# EAGLE design board 4 (EAGLE 8.4.1)
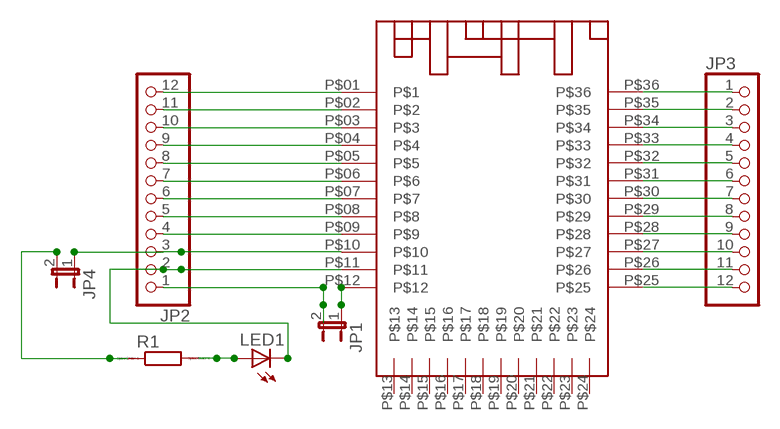
[diagram p0: schematic, sheet 1]

## Parts
JP1  JP1E  [JP1]
JP2  PINHD-1X12  [1X12]
JP3  PINHD-1X12  [1X12]
JP4  JP1E  [JP1]
LED1  LED5MM  [LED5MM]
R1  R0207/10  [0207/10]
U$1  HZX_MODULE  [SMD_PAD_VERSION]

## Nets
N$1: LED1.A R1.2
N$2: JP2.3 JP4.1 U$1.P$10
N$3: JP2.2 LED1.K(C) U$1.P$11
N$4: JP2.4 U$1.P$09
N$5: JP2.5 U$1.P$08
N$6: JP2.6 U$1.P$07
N$7: JP2.7 U$1.P$06
N$8: JP2.8 U$1.P$05
N$9: JP2.9 U$1.P$04
N$10: JP2.10 U$1.P$03
N$11: JP2.11 U$1.P$02
N$12: JP2.12 U$1.P$01
N$13: JP3.1 U$1.P$36
N$14: JP3.2 U$1.P$35
N$15: JP3.3 U$1.P$34
N$16: JP3.4 U$1.P$33
N$17: JP3.5 U$1.P$32
N$18: JP3.6 U$1.P$31
N$19: JP3.7 U$1.P$30
N$20: JP3.8 U$1.P$29
N$21: JP3.9 U$1.P$28
N$22: JP3.10 U$1.P$27
N$23: JP3.11 U$1.P$26
N$24: JP3.12 U$1.P$25
N$25: JP1.2 JP2.1
N$26: JP1.1 U$1.P$12
N$27: JP4.2 R1.1
Unconnected: U$1.P$13 U$1.P$14 U$1.P$15 U$1.P$16 U$1.P$17 U$1.P$18 U$1.P$19 U$1.P$20 U$1.P$21 U$1.P$22 U$1.P$23 U$1.P$24

## Library data of the parts
JP1 JP4 = jumper:JP1E: JUMPER
JP2 JP3 = pinhead:PINHD-1X12: PIN HEADER
LED1 = led:LED: LED OSRAM: - CHIPLED LG R971, LG N971, LY N971, LG Q971, LY Q971, LO R971, LY R971 LH N974, LH R974 LS Q976, LO Q976, LY Q976 LO Q996 - Hyper CHIPLED LW Q18S LB Q993, LB Q99A, LB R99A - SideLED LS A670, LO A670, LY A670, LG A670, LP A670 LB A673, LV A673, LT A673, LW A673 LH A674 LY A675 LS A676, LA A676, LO A676, LY A676, LW A676 LS A679, LY A679, LG A679 - Hyper Micro SIDELED® LS Y876, LA Y876, LO Y876, LY Y876 LT Y87S - SmartLED LW L88C, LW L88S LB L89C, LB L89S, LG L890 LS L89K, LO L89K, LY L89K LS L896, LA L896, LO L896, LY L896 - TOPLED LS T670, LO T670, LY T670, LG T670, LP T670 LSG T670, LSP T670, LSY T670, LOP T670, LYG T670 LG T671, LOG T671, LSG T671 LB T673, LV T673, LT T673, LW T673 LH T674 LS T676, LA T676, LO T676, LY T676, LB T676, LH T676, LSB T676, LW T676 LB T67C, LV T67C, LT T67C, LS T67K, LO T67K, LY T67K, LW E67C LS E67B, LA E67B, LO E67B, LY E67B, LB E67C, LV E67C, LT E67C LW T67C LS T679, LY T679, LG T679 LS T770, LO T770, LY T770, LG T770, LP T770 LB T773, LV T773, LT T773, LW T773 LH T774 LS E675, LA E675, LY E675, LS T675 LS T776, LA T776, LO T776, LY T776, LB T776 LHGB T686 LT T68C, LB T68C - Hyper Mini TOPLED® LB M676 - Mini TOPLED Santana® LG M470 LS M47K, LO M47K, LY M47K Source: http://www.osram.convergy.de LUXEON: - LUMILED® LXK2-PW12-R00, LXK2-PW12-S00, LXK2-PW14-U00, LXK2-PW14-V00 LXK2-PM12-R00, LXK2-PM12-S00, LXK2-PM14-U00 LXK2-PE12-Q00, LXK2-PE12-R00, LXK2-PE12-S00, LXK2-PE14-T00, LXK2-PE14-U00 LXK2-PB12-K00, LXK2-PB12-L00, LXK2-PB12-M00, LXK2-PB14-N00, LXK2-PB14-P00, LXK2-PB14-Q00 LXK2-PR12-L00, LXK2-PR12-M00, LXK2-PR14-Q00, LXK2-PR14-R00 LXK2-PD12-Q00, LXK2-PD12-R00, LXK2-PD12-S00 LXK2-PH12-R00, LXK2-PH12-S00 LXK2-PL12-P00, LXK2-PL12-Q00, LXK2-PL12-R00 Source: www.luxeon.com KINGBRIGHT: KA-3528ASYC Source: www.kingbright.com
R1 = eagle-ltspice:R: RESISTOR, European symbol; SPICEMODEL: NONE; SPICEPREFIX: R
U$1 = HZX_MODULE:HZX_MODULE; AUTHOR: Agam

## Board
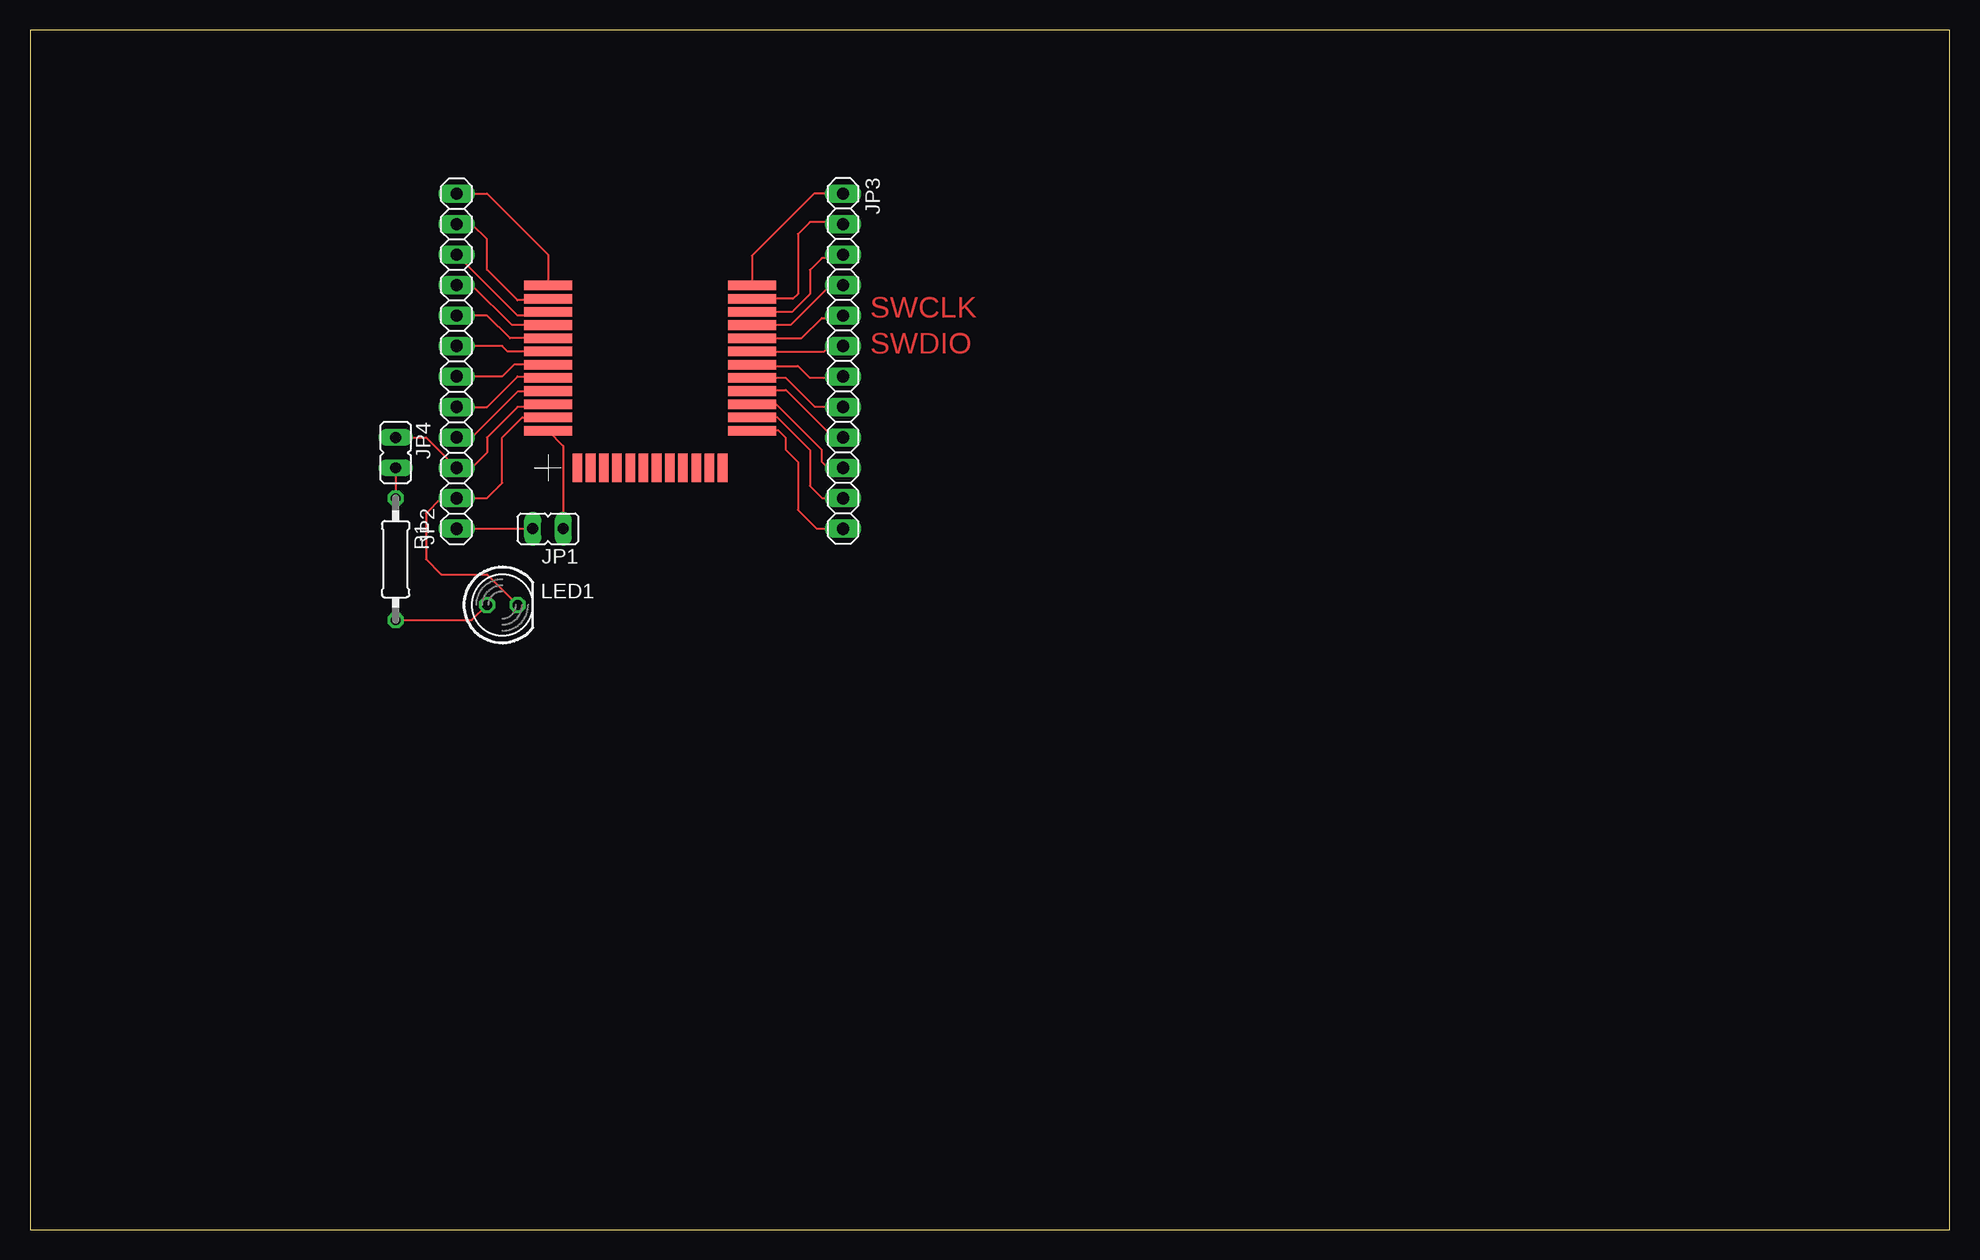
[diagram p1: board, top side]

Size 160 x 100 mm. Coordinates in mm from the lower left corner, seen from the top.
Outline: 0,0 160,0 160,100 0,100 0,0
Copper layers (1*16): Top 0.035mm / dielectric 1.5mm / Bottom 0.035mm
Design rules "default": minimum track width 6mil, minimum drill 0.35mm, track to track 6mil, track to pad 6mil, pad to pad 6mil, via to via 6mil, smd to smd 6mil, copper to edge 40mil, drill to drill 6mil, minimum pad ring 10mil, minimum via ring 8mil, stop-mask expansion 4mil, vias tented up to drill 0mil, thermal gap 10mil

### Footprints (pad centres in the part's own frame; a part is rotated, then mirrored left to right if it is on the bottom)
JP1 = drill 0.914 long: 1 0,-1.27; 2 0,1.27
1X12 = drill 1.016 long: 1 -13.97,0; 2 -11.43,0; 3 -8.89,0; 4 -6.35,0; 5 -3.81,0; 6 -1.27,0; 7 1.27,0; 8 3.81,0; 9 6.35,0; 10 8.89,0; 11 11.43,0; 12 13.97,0
LED5MM = drill 0.813 octagon: A -1.27,0; K 1.27,0
0207/10 = drill 0.813 octagon: 1 -5.08,0; 2 5.08,0
SMD_PAD_VERSION = smd 4 x 0.8: P$01 0,15.2; P$02 0,14.1; P$03 0,13; P$04 0,11.9; P$05 0,10.8; P$06 0,9.7; P$07 0,8.6; P$08 0,7.5; P$09 0,6.4; P$10 0,5.3; P$11 0,4.2; P$12 0,3.1; P$25 17,3.1; P$26 17,4.2; P$27 17,5.3; P$28 17,6.4; P$29 17,7.5; P$30 17,8.6; P$31 17,9.7; P$32 17,10.8; P$33 17,11.9; P$34 17,13; P$35 17,14.1; P$36 17,15.2 | smd 0.8 x 2.4: P$13 2.45,0; P$14 3.55,0; P$15 4.65,0; P$16 5.75,0; P$17 6.85,0; P$18 7.95,0; P$19 9.05,0; P$20 10.15,0; P$21 11.25,0; P$22 12.35,0; P$23 13.45,0; P$24 14.55,0

### Placement (x,y rotation side)
JP1  43.18,58.42 90 top
JP2  35.56,72.39 90 top
JP3  67.77,72.39 270 top
JP4  30.48,64.77 180 top
LED1  39.37,52.07 0 top
R1  30.48,55.88 270 top
U$1  43.18,63.5 0 top

### Tracks (layer width: path | path; a pad name or v marks a point on that pad's centre or on a via)
N$1
  Top 0.152: R1.2 36.83,50.8 LED1.A
N$2
  Top 0.152: U$1.P$10 42.96,68.58 40.64,68.58 38.1,66.04 38.1,64.77 36.83,63.5 JP2.3 33.02,66.04 JP4.1
N$3
  Top 0.152: LED1.K 38.1,54.61 34.29,54.61 33.02,55.88 33.02,59.69 34.29,60.96 JP2.2 38.1,60.96 39.37,62.23 39.37,66.04 41.03,67.7 U$1.P$11
N$4
  Top 0.152: U$1.P$09 43.13,69.85 40.64,69.85 36.83,66.04 JP2.4
N$5
  Top 0.152: JP2.5 38.1,68.58 40.64,71.12 41.91,71.12 42.03,71 U$1.P$08
N$6
  Top 0.152: U$1.P$07 40.35,72.1 39.37,71.12 JP2.6
N$7
  Top 0.152: U$1.P$06 39.83,73.2 39.37,73.66 JP2.7
N$8
  Top 0.152: U$1.P$05 40,74.3 38.1,76.2 JP2.8
N$9
  Top 0.152: U$1.P$04 40.17,75.4 36.83,78.74 JP2.9
N$10
  Top 0.152: U$1.P$03 42.88,76.2 40.64,76.2 JP2.10
N$11
  Top 0.152: U$1.P$02 43.05,77.47 40.64,77.47 38.1,80.01 38.1,82.55 36.83,83.82 JP2.11
N$12
  Top 0.152: JP2.12 38.1,86.36 43.18,81.28 U$1.P$01
N$13
  Top 0.152: JP3.1 65.36,86.36 60.18,81.18 U$1.P$36
N$14
  Top 0.152: JP3.2 67.59,84 65,84 64,83 64,78 63.6,77.6 U$1.P$35
N$15
  Top 0.152: JP3.3 67.49,81 66,81 65,80 65,78 63.5,76.5 U$1.P$34
N$16
  Top 0.152: JP3.4 66.74,78.74 63.4,75.4 U$1.P$33
N$17
  Top 0.152: U$1.P$32 64.3,74.3 66,76 67.57,76 JP3.5
N$18
  Top 0.152: U$1.P$31 66.2,73.2 67,74 67.34,73.66 JP3.6
N$19
  Top 0.152: JP3.7 67.65,71 65,71 64,72 60,72 60.1,72.1 U$1.P$30
N$20
  Top 0.152: JP3.8 65.42,68.58 63,71 U$1.P$29
N$21
  Top 0.152: U$1.P$28 61.9,69.9 62,70 63,70 67,66 67.73,66 JP3.9
N$22
  Top 0.152: JP3.10 66.5,63.5 66,64 66,65 62.2,68.8 U$1.P$27
N$23
  Top 0.152: U$1.P$26 62.3,67.7 65,65 65,62 66.04,60.96 JP3.11
N$24
  Top 0.152: U$1.P$25 62.4,66.6 63,66 63,65 64,64 64,60 65.58,58.42 JP3.12
N$25
  Top 0.152: JP2.1 JP1.2
N$26
  Top 0.152: U$1.P$12 44.45,65.33 JP1.1
N$27
  Top 0.152: JP4.2 R1.1

### Text on the board
Top: SWCLK | SWDIO